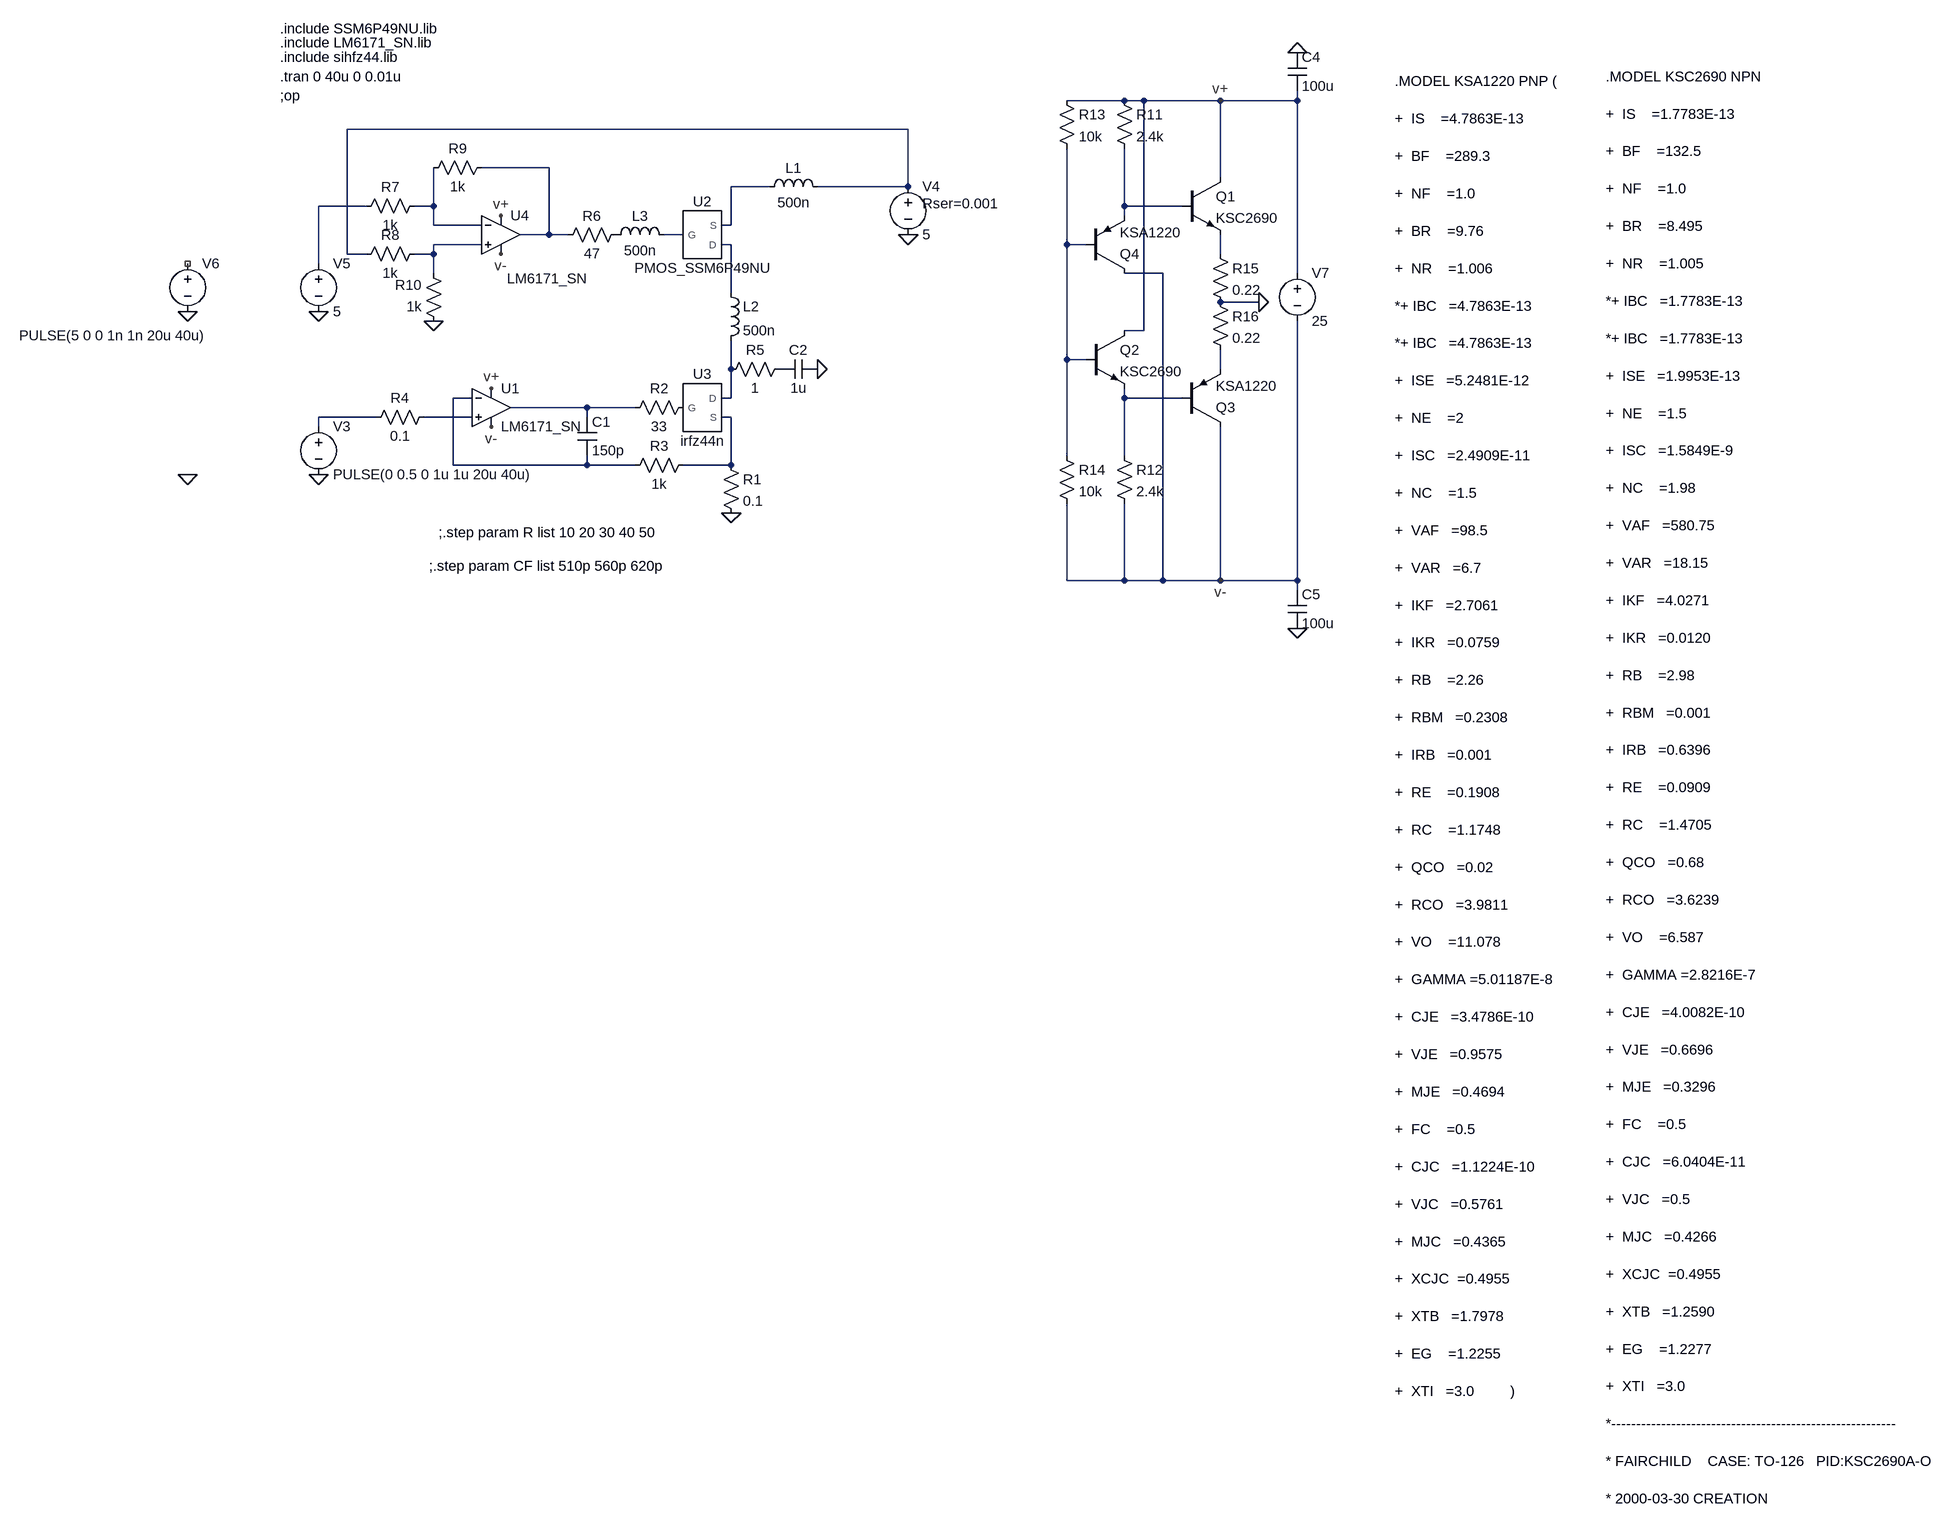
[diagram p0: schematic PFETchar1.asc]
PFETchar1.asc, the LTspice schematic file:
Version 4
SHEET 1 2640 680
WIRE 1200 -368 1104 -368
WIRE 1232 -368 1200 -368
WIRE 1360 -368 1232 -368
WIRE 1488 -368 1488 -384
WIRE 1488 -368 1360 -368
WIRE 656 -320 -304 -320
WIRE 32 -256 -80 -256
WIRE 1360 -240 1360 -368
WIRE 400 -224 336 -224
WIRE 656 -224 656 -320
WIRE 656 -224 480 -224
WIRE -272 -192 -352 -192
WIRE -160 -192 -160 -256
WIRE -160 -192 -192 -192
WIRE 1200 -192 1200 -288
WIRE 1296 -192 1200 -192
WIRE 1200 -176 1200 -192
WIRE -160 -160 -160 -192
WIRE -80 -160 -160 -160
WIRE 336 -160 336 -224
WIRE 336 -160 320 -160
WIRE 32 -144 32 -256
WIRE 32 -144 -16 -144
WIRE 64 -144 32 -144
WIRE 256 -144 224 -144
WIRE -80 -128 -160 -128
WIRE 336 -128 320 -128
WIRE 1104 -128 1104 -288
WIRE 1136 -128 1104 -128
WIRE -304 -112 -304 -320
WIRE -272 -112 -304 -112
WIRE -160 -112 -160 -128
WIRE -160 -112 -192 -112
WIRE 1360 -112 1360 -144
WIRE -352 -96 -352 -192
WIRE -160 -80 -160 -112
WIRE 1264 -80 1200 -80
WIRE 1488 -80 1488 -368
WIRE 336 -48 336 -128
WIRE 1424 -32 1360 -32
WIRE 1232 16 1232 -368
WIRE 1232 16 1200 16
WIRE 1104 64 1104 -128
WIRE 1136 64 1104 64
WIRE 336 80 336 32
WIRE 1360 80 1360 48
WIRE -96 128 -128 128
WIRE 336 128 336 80
WIRE 336 128 320 128
WIRE 1200 128 1200 112
WIRE 1296 128 1200 128
WIRE 96 144 -32 144
WIRE 176 144 96 144
WIRE -256 160 -352 160
WIRE -96 160 -176 160
WIRE 96 160 96 144
WIRE 336 160 320 160
WIRE -352 176 -352 160
WIRE 1104 224 1104 64
WIRE 1200 224 1200 128
WIRE -128 240 -128 128
WIRE 96 240 96 224
WIRE 96 240 -128 240
WIRE 176 240 96 240
WIRE 336 240 336 160
WIRE 336 240 256 240
WIRE 1104 432 1104 304
WIRE 1200 432 1200 304
WIRE 1200 432 1104 432
WIRE 1264 432 1264 -80
WIRE 1264 432 1200 432
WIRE 1360 432 1360 176
WIRE 1360 432 1264 432
WIRE 1488 432 1488 0
WIRE 1488 432 1360 432
WIRE 1488 448 1488 432
FLAG 1360 -368 v+
FLAG 1360 432 v-
FLAG -64 112 v+
FLAG -64 176 v-
FLAG 336 320 0
FLAG -352 256 0
FLAG 656 -144 0
FLAG 480 80 0
FLAG -48 -176 v+
FLAG -48 -112 v-
FLAG -160 0 0
FLAG -720 256 0
FLAG -352 -16 0
FLAG -720 -16 0
FLAG 1424 -32 0
FLAG 1488 -448 0
FLAG 1488 512 0
SYMBOL Opamps\\opamp2 -64 80 R0
SYMATTR InstName U1
SYMATTR Value LM6171_SN
SYMBOL res 320 224 R0
SYMATTR InstName R1
SYMATTR Value 0.1
SYMBOL res 272 128 R90
WINDOW 0 0 56 VBottom 2
WINDOW 3 32 56 VTop 2
SYMATTR InstName R2
SYMATTR Value 33
SYMBOL res 272 224 R90
WINDOW 0 0 56 VBottom 2
WINDOW 3 32 56 VTop 2
SYMATTR InstName R3
SYMATTR Value 1k
SYMBOL cap 80 160 R0
SYMATTR InstName C1
SYMATTR Value 150p
SYMBOL voltage -352 160 R0
WINDOW 123 0 0 Left 2
WINDOW 39 0 0 Left 2
SYMATTR InstName V3
SYMATTR Value PULSE(0 0.5 0 1u 1u 20u 40u)
SYMBOL voltage 656 -240 R0
WINDOW 123 0 0 Left 2
WINDOW 39 24 44 Left 2
SYMATTR SpiceLine Rser=0.001
SYMATTR InstName V4
SYMATTR Value 5
SYMBOL PMOS_SSM6P49NU 288 -144 R0
SYMATTR InstName U2
SYMBOL ind 384 -208 R270
WINDOW 0 32 56 VTop 2
WINDOW 3 5 56 VBottom 2
SYMATTR InstName L1
SYMATTR Value 500n
SYMBOL ind 320 -64 R0
SYMATTR InstName L2
SYMATTR Value 500n
SYMBOL ind 128 -128 R270
WINDOW 0 32 56 VTop 2
WINDOW 3 5 56 VBottom 2
SYMATTR InstName L3
SYMATTR Value 500n
SYMBOL res -160 144 R90
WINDOW 0 0 56 VBottom 2
WINDOW 3 32 56 VTop 2
SYMATTR InstName R4
SYMATTR Value 0.1
SYMBOL irfz44n 288 144 R0
SYMATTR InstName U3
SYMBOL res 432 64 R90
WINDOW 0 0 56 VBottom 2
WINDOW 3 32 56 VTop 2
SYMATTR InstName R5
SYMATTR Value 1
SYMBOL cap 480 64 R90
WINDOW 0 0 32 VBottom 2
WINDOW 3 32 32 VTop 2
SYMATTR InstName C2
SYMATTR Value 1u
SYMATTR SpiceLine Lser=10n
SYMBOL Opamps\\opamp2 -48 -208 R0
WINDOW 3 10 137 Left 2
SYMATTR Value LM6171_SN
SYMATTR InstName U4
SYMBOL res 160 -160 R90
WINDOW 0 0 56 VBottom 2
WINDOW 3 32 56 VTop 2
SYMATTR InstName R6
SYMATTR Value 47
SYMBOL res -176 -208 R90
WINDOW 0 0 56 VBottom 2
WINDOW 3 32 56 VTop 2
SYMATTR InstName R7
SYMATTR Value 1k
SYMBOL res -176 -128 R90
WINDOW 0 0 56 VBottom 2
WINDOW 3 32 56 VTop 2
SYMATTR InstName R8
SYMATTR Value 1k
SYMBOL res -64 -272 R90
WINDOW 0 0 56 VBottom 2
WINDOW 3 32 56 VTop 2
SYMATTR InstName R9
SYMATTR Value 1k
SYMBOL res -144 16 R180
WINDOW 0 36 76 Left 2
WINDOW 3 36 40 Left 2
SYMATTR InstName R10
SYMATTR Value 1k
SYMBOL voltage -352 -112 R0
WINDOW 123 0 0 Left 2
WINDOW 39 0 0 Left 2
SYMATTR InstName V5
SYMATTR Value 5
SYMBOL voltage -720 -112 R0
WINDOW 3 -281 136 Left 2
WINDOW 123 0 0 Left 2
WINDOW 39 0 0 Left 2
SYMATTR Value PULSE(5 0 0 1n 1n 20u 40u)
SYMATTR InstName V6
SYMBOL voltage 1488 -96 R0
WINDOW 123 0 0 Left 2
WINDOW 39 0 0 Left 2
SYMATTR InstName V7
SYMATTR Value 25
SYMBOL npn 1296 -240 R0
SYMATTR InstName Q1
SYMATTR Value KSC2690
SYMBOL npn 1136 16 R0
SYMATTR InstName Q2
SYMATTR Value KSC2690
SYMBOL pnp 1296 176 M180
SYMATTR InstName Q3
SYMATTR Value KSA1220
SYMBOL pnp 1136 -80 M180
SYMATTR InstName Q4
SYMATTR Value KSA1220
SYMBOL res 1184 -384 R0
SYMATTR InstName R11
SYMATTR Value 2.4k
SYMBOL res 1184 208 R0
SYMATTR InstName R12
SYMATTR Value 2.4k
SYMBOL res 1088 -384 R0
SYMATTR InstName R13
SYMATTR Value 10k
SYMBOL res 1088 208 R0
SYMATTR InstName R14
SYMATTR Value 10k
SYMBOL res 1344 -128 R0
SYMATTR InstName R15
SYMATTR Value 0.22
SYMBOL res 1344 -48 R0
SYMATTR InstName R16
SYMATTR Value 0.22
SYMBOL cap 1472 -448 R0
SYMATTR InstName C4
SYMATTR Value 100u
SYMATTR SpiceLine Rser=0.1 Lser=5n
SYMBOL cap 1472 448 R0
SYMATTR InstName C5
SYMATTR Value 100u
SYMATTR SpiceLine Rser=0.1 Lser=5n
TEXT -416 -376 Left 2 !;op
TEXT -416 -464 Left 2 !.include LM6171_SN.lib
TEXT -416 -408 Left 2 !.tran 0 40u 0 0.01u
TEXT -168 408 Left 2 !;.step param CF list 510p 560p 620p
TEXT -416 -440 Left 2 !.include sihfz44.lib
TEXT -416 -488 Left 2 !.include SSM6P49NU.lib
TEXT -152 352 Left 2 !;.step param R list 10 20 30 40 50
TEXT 1664 -400 Left 2 !.MODEL KSA1220 PNP ( \n\n+  IS    =4.7863E-13      \n\n+  BF    =289.3\n\n+  NF    =1.0 \n\n+  BR    =9.76\n\n+  NR    =1.006\n\n*+ IBC   =4.7863E-13\n\n*+ IBC   =4.7863E-13\n\n+  ISE   =5.2481E-12\n\n+  NE    =2\n\n+  ISC   =2.4909E-11\n\n+  NC    =1.5\n\n+  VAF   =98.5\n\n+  VAR   =6.7\n\n+  IKF   =2.7061\n\n+  IKR   =0.0759\n\n+  RB    =2.26\n\n+  RBM   =0.2308\n\n+  IRB   =0.001\n\n+  RE    =0.1908\n\n+  RC    =1.1748\n\n+  QCO   =0.02\n\n+  RCO   =3.9811\n\n+  VO    =11.078\n\n+  GAMMA =5.01187E-8\n\n+  CJE   =3.4786E-10\n\n+  VJE   =0.9575\n\n+  MJE   =0.4694\n\n+  FC    =0.5\n\n+  CJC   =1.1224E-10\n\n+  VJC   =0.5761\n\n+  MJC   =0.4365\n\n+  XCJC  =0.4955   \n\n+  XTB   =1.7978    \n\n+  EG    =1.2255 \n\n+  XTI   =3.0         )
TEXT 2016 -408 Left 2 !.MODEL KSC2690 NPN\n\n+  IS    =1.7783E-13      \n\n+  BF    =132.5\n\n+  NF    =1.0 \n\n+  BR    =8.495\n\n+  NR    =1.005\n\n*+ IBC   =1.7783E-13 \n\n*+ IBC   =1.7783E-13 \n\n+  ISE   =1.9953E-13\n\n+  NE    =1.5\n\n+  ISC   =1.5849E-9\n\n+  NC    =1.98\n\n+  VAF   =580.75\n\n+  VAR   =18.15\n\n+  IKF   =4.0271\n\n+  IKR   =0.0120\n\n+  RB    =2.98\n\n+  RBM   =0.001\n\n+  IRB   =0.6396\n\n+  RE    =0.0909\n\n+  RC    =1.4705\n\n+  QCO   =0.68\n\n+  RCO   =3.6239\n\n+  VO    =6.587\n\n+  GAMMA =2.8216E-7\n\n+  CJE   =4.0082E-10\n\n+  VJE   =0.6696\n\n+  MJE   =0.3296\n\n+  FC    =0.5\n\n+  CJC   =6.0404E-11\n\n+  VJC   =0.5\n\n+  MJC   =0.4266\n\n+  XCJC  =0.4955   \n\n+  XTB   =1.2590    \n\n+  EG    =1.2277 \n\n+  XTI   =3.0         \n\n*---------------------------------------------------------\n\n* FAIRCHILD    CASE: TO-126   PID:KSC2690A-O\n\n* 2000-03-30 CREATION

The netlist it stands for:
* PFETchar1.asc
XU1 N018 N014 v+ v- N016 LM6171_SN  ; pins In+ In- V+ V- OUT
R1 N019 0 0.1
R2 P001 N016 33
R3 N019 N014 1k
C1 N016 N014 150p
V3 N017 0 PULSE(0 0.5 0 1u 1u 20u 40u)
V4 N001 0 5 Rser=0.001
XU2 N009 N007 N003 PMOS_SSM6P49NU  ; pins D G S
L1 N003 N001 500n
L2 N009 N012 500n
L3 P002 N007 500n
R4 N018 N017 0.1
XU3 N012 P001 N019 irfz44n  ; pins D G S
R5 P003 N012 1
C2 0 P003 1u Lser=10n
XU4 N008 N005 v+ v- N002 LM6171_SN  ; pins In+ In- V+ V- OUT
R6 P002 N002 47
R7 N005 N004 1k
R8 N008 N001 1k
R9 N002 N005 1k
R10 0 N008 1k
V5 N004 0 5
V6 NC_01 0 PULSE(5 0 0 1n 1n 20u 40u)
V7 v+ v- 25
Q1 v+ N006 N011 0 KSC2690
Q2 v+ N010 N015 0 KSC2690
Q3 v- N015 N013 0 KSA1220
Q4 v- N010 N006 0 KSA1220
R11 v+ N006 2.4k
R12 N015 v- 2.4k
R13 v+ N010 10k
R14 N010 v- 10k
R15 N011 0 0.22
R16 0 N013 0.22
C4 0 v+ 100u Rser=0.1 Lser=5n
C5 v- 0 100u Rser=0.1 Lser=5n
.model NPN NPN
.model PNP PNP
.lib standard.bjt
;op
.include LM6171_SN.lib
.tran 0 40u 0 0.01u
;.step param CF list 510p 560p 620p
.include sihfz44.lib
.include SSM6P49NU.lib
;.step param R list 10 20 30 40 50
.MODEL KSA1220 PNP (
+  IS    =4.7863E-13
+  BF    =289.3
+  NF    =1.0
+  BR    =9.76
+  NR    =1.006
*+ IBC   =4.7863E-13
*+ IBC   =4.7863E-13
+  ISE   =5.2481E-12
+  NE    =2
+  ISC   =2.4909E-11
+  NC    =1.5
+  VAF   =98.5
+  VAR   =6.7
+  IKF   =2.7061
+  IKR   =0.0759
+  RB    =2.26
+  RBM   =0.2308
+  IRB   =0.001
+  RE    =0.1908
+  RC    =1.1748
+  QCO   =0.02
+  RCO   =3.9811
+  VO    =11.078
+  GAMMA =5.01187E-8
+  CJE   =3.4786E-10
+  VJE   =0.9575
+  MJE   =0.4694
+  FC    =0.5
+  CJC   =1.1224E-10
+  VJC   =0.5761
+  MJC   =0.4365
+  XCJC  =0.4955
+  XTB   =1.7978
+  EG    =1.2255
+  XTI   =3.0         )
.MODEL KSC2690 NPN
+  IS    =1.7783E-13
+  BF    =132.5
+  NF    =1.0
+  BR    =8.495
+  NR    =1.005
*+ IBC   =1.7783E-13
*+ IBC   =1.7783E-13
+  ISE   =1.9953E-13
+  NE    =1.5
+  ISC   =1.5849E-9
+  NC    =1.98
+  VAF   =580.75
+  VAR   =18.15
+  IKF   =4.0271
+  IKR   =0.0120
+  RB    =2.98
+  RBM   =0.001
+  IRB   =0.6396
+  RE    =0.0909
+  RC    =1.4705
+  QCO   =0.68
+  RCO   =3.6239
+  VO    =6.587
+  GAMMA =2.8216E-7
+  CJE   =4.0082E-10
+  VJE   =0.6696
+  MJE   =0.3296
+  FC    =0.5
+  CJC   =6.0404E-11
+  VJC   =0.5
+  MJC   =0.4266
+  XCJC  =0.4955
+  XTB   =1.2590
+  EG    =1.2277
+  XTI   =3.0
*---------------------------------------------------------
* FAIRCHILD    CASE: TO-126   PID:KSC2690A-O
* 2000-03-30 CREATION
.lib O:\SPICE\Projects\SSM6P49NU.lib
.lib sihfz44.lib
.backanno
.end